# Altium schematic sheet MCU.SchDoc: Mynd-MCU
size A3; PageSetup: Record=PageOptions|CenterHorizontal=True|CenterVertical=True|PrintScale=0.71|XCorrection=1.00|YCorrection=1.00|PrintKind=0|BorderSize=5000000|LeftOffset=0|BottomOffset=0|Orientation=2|PaperLength=1000|PaperWidth=1000|Scale=100|PaperSource=7|PrintQuality=-3|MediaType=1|DitherType=10|PrintScaleMode=1|PaperKind=A4|PaperIndex=9; SheetNumber: 4; SheetTotal: 6
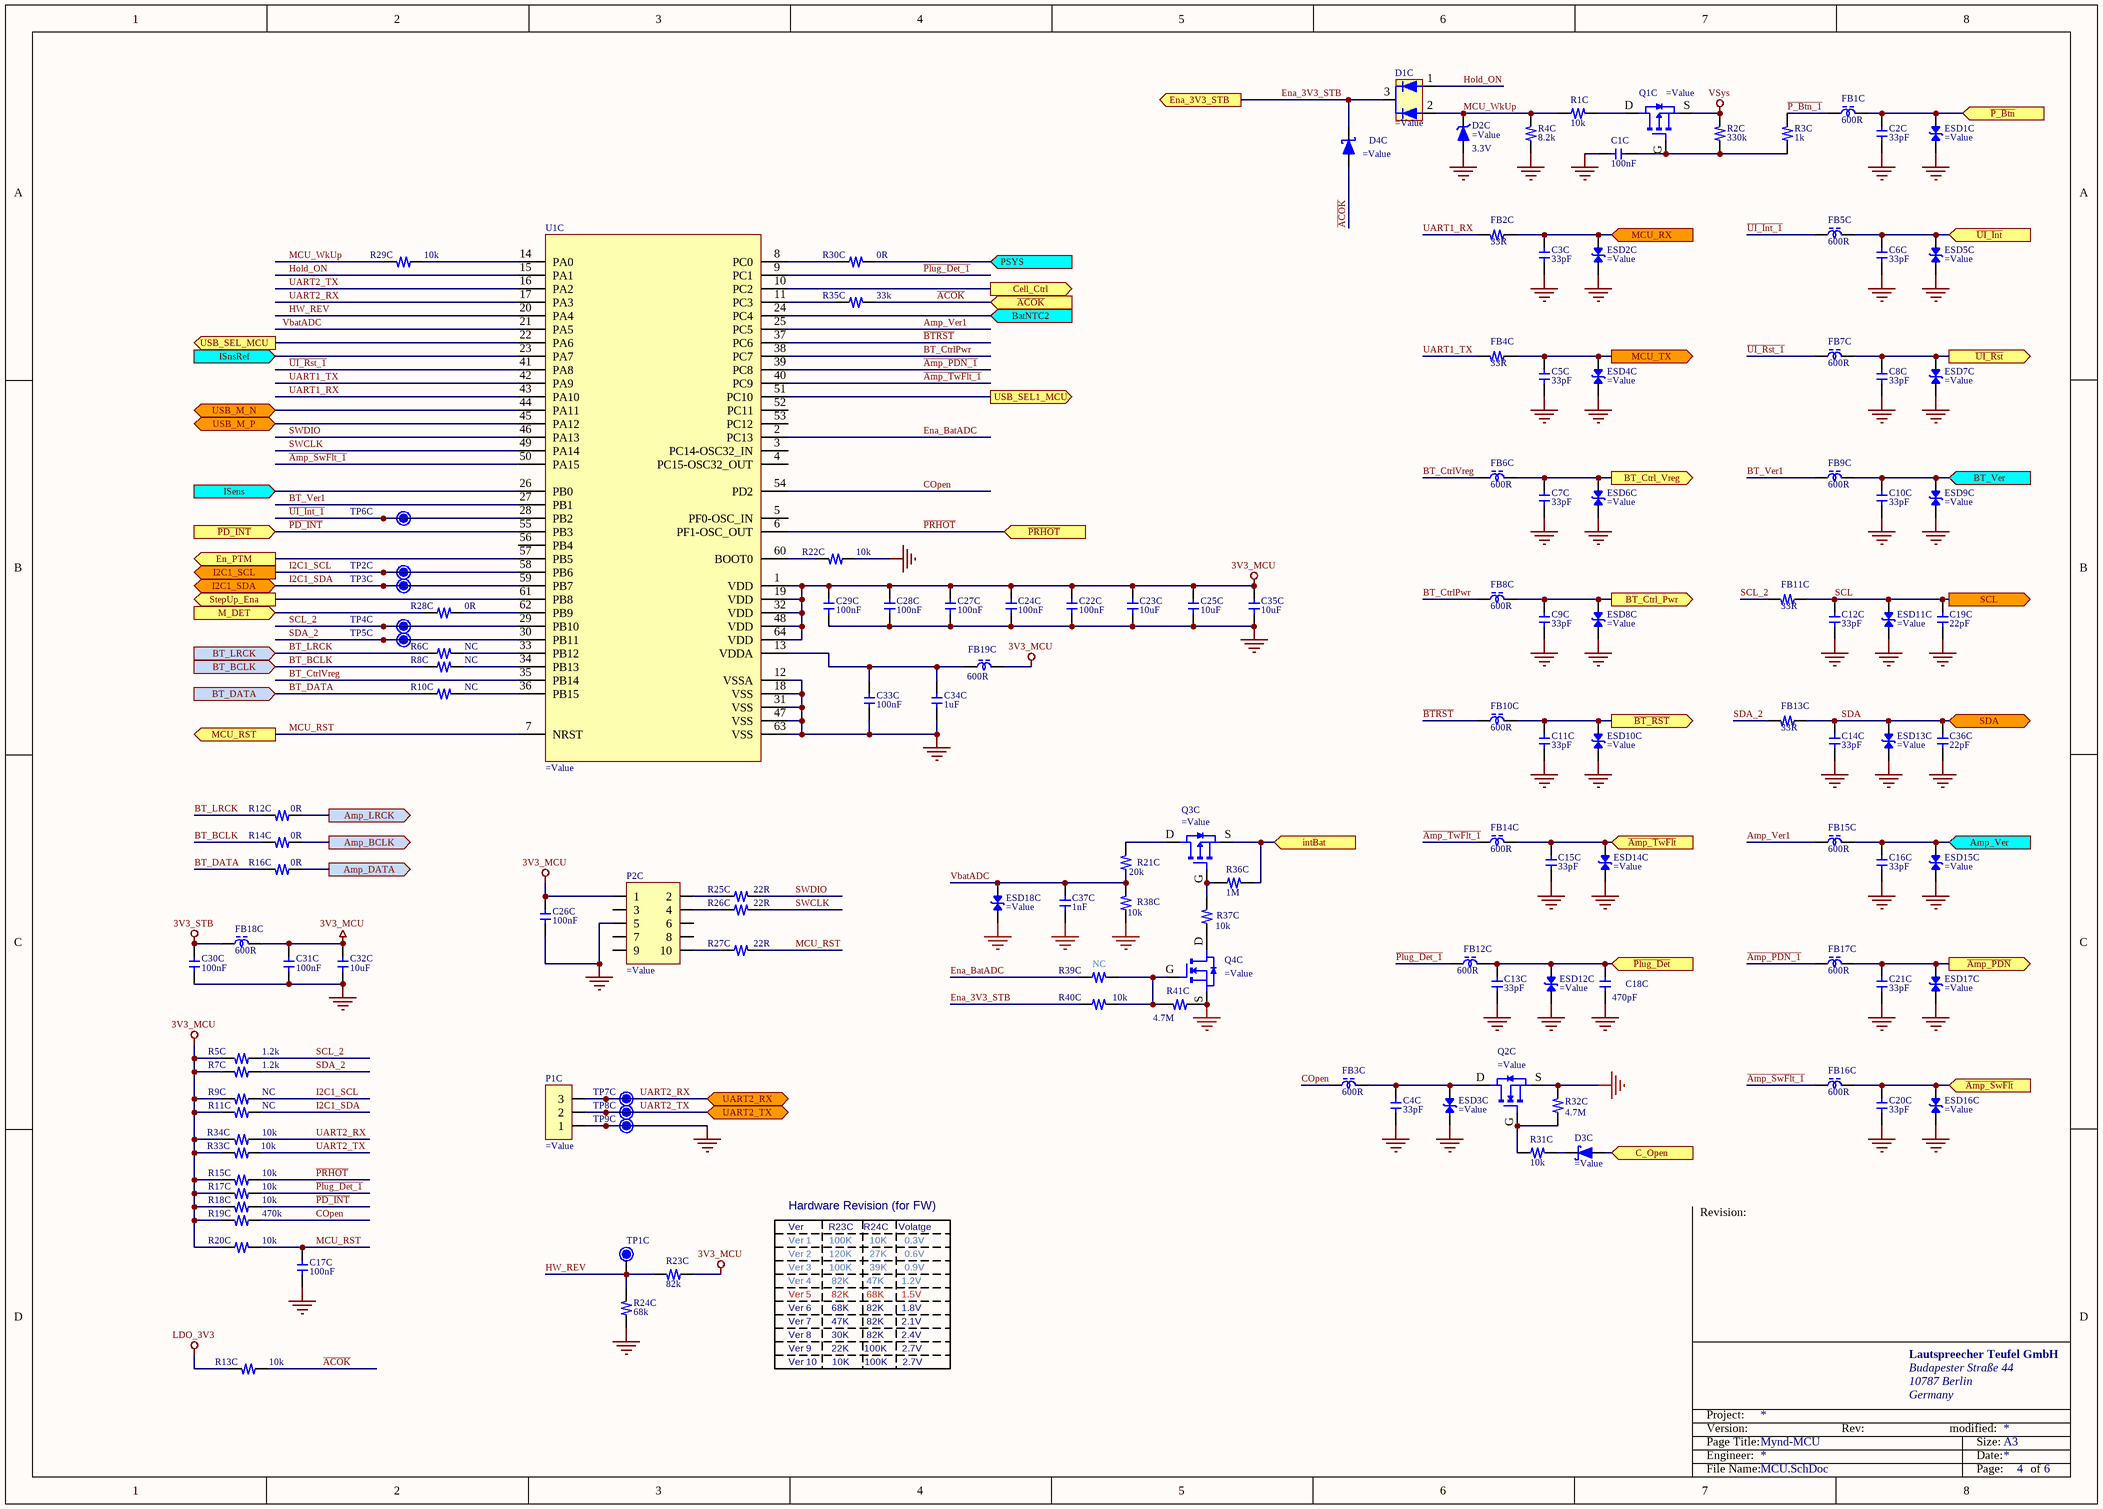
[diagram p0: MCU.SchDoc]

## Parts
C1C  100nF  [C0603X100]
C2C  33pF  [C0603X80]
C3C  33pF  [C0603X80]
C4C  33pF  [C0603X80]
C5C  33pF  [C0603X80]
C6C  33pF  [C0603X80]
C7C  33pF  [C0603X80]
C8C  33pF  [C0603X80]
C9C  33pF  [C0603X80]
C10C  33pF  [C0603X80]
C11C  33pF  [C0603X80]
C12C  33pF  [C0603X80]
C13C  33pF  [C0603X80]
C14C  33pF  [C0603X80]
C15C  33pF  [C0603X80]
C16C  33pF  [C0603X80]
C17C  100nF  [C0603X100]
C18C  470pF  [C0603X80]
C19C  22pF  [C0603X80]
C20C  33pF  [C0603X80]
C21C  33pF  [C0603X80]
C22C  100nF  [C0603X100]
C23C  10uF  [C0805_145]
C24C  100nF  [C0603X100]
C25C  10uF  [C0805_145]
C26C  100nF  [C0603X100]
C27C  100nF  [C0603X100]
C28C  100nF  [C0603X100]
C29C  100nF  [C0603X100]
C30C  100nF  [C0603X100]
C31C  100nF  [C0603X100]
C32C  10uF  [C0805_145]
C33C  100nF  [C0603X100]
C34C  1uF  [C0603X105]
C35C  10uF  [C0805_145]
C36C  22pF  [C0603X80]
C37C  1nF  [C0603X100]
D1C  (no value)  [SOT23-123]
D2C  Voltage: 3.3V  [SOD-123]
D3C  (no value)  [SOD-323]
D4C  (no value)  [SOD-323]
ESD1C  (no value)  [DFN2_100X60X50_65]
ESD2C  (no value)  [DFN2_100X60X50_65]
ESD3C  (no value)  [DFN2_100X60X50_65]
ESD4C  (no value)  [DFN2_100X60X50_65]
ESD5C  (no value)  [DFN2_100X60X50_65]
ESD6C  (no value)  [DFN2_100X60X50_65]
ESD7C  (no value)  [DFN2_100X60X50_65]
ESD8C  (no value)  [DFN2_100X60X50_65]
ESD9C  (no value)  [DFN2_100X60X50_65]
ESD10C  (no value)  [DFN2_100X60X50_65]
ESD11C  (no value)  [DFN2_100X60X50_65]
ESD12C  (no value)  [DFN2_100X60X50_65]
ESD13C  (no value)  [DFN2_100X60X50_65]
ESD14C  (no value)  [DFN2_100X60X50_65]
ESD15C  (no value)  [DFN2_100X60X50_65]
ESD16C  (no value)  [DFN2_100X60X50_65]
ESD17C  (no value)  [DFN2_100X60X50_65]
ESD18C  (no value)  [DFN2_100X60X50_65]
FB1C  600R  [L0603]
FB2C  33R  [R0603]
FB3C  600R  [L0603]
FB4C  33R  [R0603]
FB5C  600R  [L0603]
FB6C  600R  [L0603]
FB7C  600R  [L0603]
FB8C  600R  [L0603]
FB9C  600R  [L0603]
FB10C  600R  [L0603]
FB11C  33R  [R0603]
FB12C  600R  [L0603]
FB13C  33R  [R0603]
FB14C  600R  [L0603]
FB15C  600R  [L0603]
FB16C  600R  [L0603]
FB17C  600R  [L0603]
FB18C  600R  [L0603]
FB19C  600R  [L0603]
P1C  (no value)  [Pin_Header_SMD_S_T_254_3P]
P2C  (no value)  [Pin_Header_2x5_127]
Q1C  (no value)  [SOT23-GSD]
Q2C  (no value)  [SOT23-GSD]
Q3C  (no value)  [SOT23-GSD]
Q4C  (no value)  [SOT23-GSD]
R1C  10k  [R0603]
R2C  330k  [R0603]
R3C  1k  [R0603]
R4C  8.2k  [R0603]
R5C  1.2k  [R0603]
R6C  NC  [R0603]
R7C  1.2k  [R0603]
R8C  NC  [R0603]
R9C  NC  [R0603]
R10C  NC  [R0603]
R11C  NC  [R0603]
R12C  0R  [R0603]
R13C  10k  [R0603]
R14C  0R  [R0603]
R15C  10k  [R0603]
R16C  0R  [R0603]
R17C  10k  [R0603]
R18C  10k  [R0603]
R19C  470k  [R0603]
R20C  10k  [R0603]
R21C  20k  [R0603]
R22C  10k  [R0603]
R23C  82k  [R0603]
R24C  68k  [R0603]
R25C  22R  [R0603]
R26C  22R  [R0603]
R27C  22R  [R0603]
R28C  0R  [R0603]
R29C  10k  [R0603]
R30C  0R  [R0603]
R31C  10k  [R0603]
R32C  4.7M  [R0603]
R33C  10k  [R0603]
R34C  10k  [R0603]
R35C  33k  [R0603]
R36C  1M  [R0603]
R37C  10k  [R0603]
R38C  10k  [R0603]
R39C  10k  [R0603]  (value not drawn)
R40C  10k  [R0603]
R41C  4.7M  [R0603]
TP1C  TP  [TP060]  (value not drawn)  (no BOM)
TP2C  TP_T_60_40  [TP_T_60_40]  (value not drawn)  (no BOM)
TP3C  TP_T_60_40  [TP_T_60_40]  (value not drawn)  (no BOM)
TP4C  TP_T_60_40  [TP_T_60_40]  (value not drawn)  (no BOM)
TP5C  TP_T_60_40  [TP_T_60_40]  (value not drawn)  (no BOM)
TP6C  TP_T_60_40  [TP_T_60_40]  (value not drawn)  (no BOM)
TP7C  TP12  [TP120]  (value not drawn)  (no BOM)
TP8C  TP12  [TP120]  (value not drawn)  (no BOM)
TP9C  TP12  [TP120]  (value not drawn)  (no BOM)
U1C  (no value)  [LQFP64_1000X1000X160_50]

## Ports
Amp_BCLK (out), Amp_DATA (out), Amp_LRCK (out), Amp_Ver (in), BatNTC2 (in), BT_BCLK (in), BT_Ctrl_Pwr (out), BT_Ctrl_Vreg (out), BT_DATA (in), BT_LRCK (in), BT_Ver (in), C_Open (in), Cell_Ctrl (out), En_PTM (out), Ena_3V3_STB (out), I2C1_SCL (out), I2C1_SDA (bidir), intBat (in), ISens (in), ISnsRef (in), M_DET (in), MCU_RST (out), MCU_RX (in), MCU_TX (out), PSYS (in), SCL (out), SDA (bidir), StepUp_Ena (out), UART2_RX (bidir), UART2_TX (bidir), USB_M_N (bidir), USB_M_P (bidir), USB_SEL1_MCU (out), USB_SEL_MCU (out), ~{ACOK} (in), ~{Amp_PDN} (out), ~{Amp_SwFlt} (in), ~{Amp_TwFlt} (in), ~{BT_RST} (out), ~{P_Btn} (in), ~{PD_INT} (in), ~{Plug_Det} (in), ~{PRHOT} (in), ~{UI_Int} (in), ~{UI_Rst} (out)

## Nets
3V3_MCU: C22C.1 C23C.1 C24C.1 C25C.1 C26C.1 C27C.1 C28C.1 C29C.1 C31C.1 C32C.1 C35C.2 FB18C.2 FB19C.2 P2C.1 R5C.1 R7C.1 R9C.1 R11C.1 R15C.1 R17C.1 R18C.1 R19C.1 R20C.2 R23C.1 R33C.1 R34C.1 U1C.1(VDD) U1C.19(VDD) U1C.32(VDD) U1C.48(VDD) U1C.64(VDD)
3V3_STB: C30C.1 FB18C.1
GND: C1C.2 C2C.2 C3C.2 C4C.2 C5C.2 C6C.2 C7C.2 C8C.2 C9C.2 C10C.2 C11C.2 C12C.2 C13C.2 C14C.2 C15C.2 C16C.2 C17C.2 C18C.2 C19C.2 C20C.2 C21C.2 C22C.2 C23C.2 C24C.2 C25C.2 C26C.2 C27C.2 C28C.2 C29C.2 C30C.2 C31C.2 C32C.2 C33C.2 C34C.2 C35C.1 C36C.2 C37C.2 D2C.A ESD1C.2 ESD2C.1 ESD3C.1 ESD4C.1 ESD5C.1 ESD6C.1 ESD7C.1 ESD8C.1 ESD9C.1 ESD10C.1 ESD11C.1 ESD12C.1 ESD13C.1 ESD14C.1 ESD15C.1 ESD16C.1 ESD17C.1 ESD18C.1 P1C.1 P2C.5 Q2C.S Q4C.S R4C.1 R22C.1 R24C.1 R32C.2 R38C.1 R41C.2 TP9C.1 U1C.12(VSSA) U1C.18(VSS) U1C.31(VSS) U1C.47(VSS) U1C.63(VSS)
LDO_3V3: R13C.1
VSys: Q1C.S R2C.2
~{ACOK}: D4C.A R13C.2 R35C.1 ; port ~{ACOK}
~{Amp_PDN_1}: FB17C.1 U1C.39(PC8)
~{Amp_SwFlt_1}: FB16C.1 U1C.50(PA15)
~{Amp_TwFlt_1}: FB14C.1 U1C.40(PC9)
~{BT_RST}: C11C.1 ESD10C.2 FB10C.2 ; port ~{BT_RST}
~{BTRST}: FB10C.1 U1C.37(PC6)
~{P_Btn}: C2C.1 ESD1C.1 FB1C.2 ; port ~{P_Btn}
~{P_Btn_1}: FB1C.1 R3C.2
~{PD_INT}: R18C.2 U1C.55(PB3) ; port ~{PD_INT}
~{Plug_Det}: C13C.1 C18C.1 ESD12C.2 FB12C.2 ; port ~{Plug_Det}
~{Plug_Det_1}: FB12C.1 R17C.2 U1C.9(PC1)
~{PRHOT}: R15C.2 U1C.6(PF1-OSC_OUT) ; port ~{PRHOT}
~{UI_Int}: C6C.1 ESD5C.2 FB5C.2 ; port ~{UI_Int}
~{UI_Int_1}: FB5C.1 TP6C.1 U1C.28(PB2)
~{UI_Rst}: C8C.1 ESD7C.2 FB7C.2 ; port ~{UI_Rst}
~{UI_Rst_1}: FB7C.1 U1C.41(PA8)
~{Amp_PDN}: C21C.1 ESD17C.2 FB17C.2 ; port ~{Amp_PDN}
~{Amp_SwFlt}: C20C.1 ESD16C.2 FB16C.2 ; port ~{Amp_SwFlt}
~{Amp_TwFlt}: C15C.1 ESD14C.2 FB14C.2 ; port ~{Amp_TwFlt}
Amp_BCLK: R14C.2 ; port Amp_BCLK
Amp_DATA: R16C.2 ; port Amp_DATA
Amp_LRCK: R12C.2 ; port Amp_LRCK
Amp_Ver: C16C.1 ESD15C.2 FB15C.2 ; port Amp_Ver
Amp_Ver1: FB15C.1 U1C.25(PC5)
BatNTC2: U1C.24(PC4) ; port BatNTC2
BT_BCLK: R8C.2 R14C.1 ; port BT_BCLK
BT_Ctrl_Pwr: C9C.1 ESD8C.2 FB8C.2 ; port BT_Ctrl_Pwr
BT_Ctrl_Vreg: C7C.1 ESD6C.2 FB6C.2 ; port BT_Ctrl_Vreg
BT_CtrlPwr: FB8C.1 U1C.38(PC7)
BT_CtrlVreg: FB6C.1 U1C.35(PB14)
BT_DATA: R10C.2 R16C.1 ; port BT_DATA
BT_LRCK: R6C.2 R12C.1 ; port BT_LRCK
BT_Ver: C10C.1 ESD9C.2 FB9C.2 ; port BT_Ver
BT_Ver1: FB9C.1 U1C.27(PB1)
C_Open: D3C.A ; port C_Open
Cell_Ctrl: U1C.10(PC2) ; port Cell_Ctrl
COpen: FB3C.1 R19C.2 U1C.54(PD2)
En_PTM: U1C.57(PB5) ; port En_PTM
Ena_3V3_STB: D1C.3 D4C.K R40C.1 ; port Ena_3V3_STB
Ena_BatADC: R39C.1 U1C.2(PC13)
Hold_ON: D1C.1 U1C.15(PA1)
HW_REV: R23C.2 R24C.2 TP1C.1 U1C.20(PA4)
I2C1_SCL: R9C.2 TP2C.1 U1C.58(PB6) ; port I2C1_SCL
I2C1_SDA: R11C.2 TP3C.1 U1C.59(PB7) ; port I2C1_SDA
intBat: Q3C.S R36C.2 ; port intBat
ISens: U1C.26(PB0) ; port ISens
ISnsRef: U1C.23(PA7) ; port ISnsRef
M_DET: R28C.2 ; port M_DET
MCU_RST: C17C.1 R20C.1 R27C.1 U1C.7(NRST) ; port MCU_RST
MCU_RX: C3C.1 ESD2C.2 FB2C.2 ; port MCU_RX
MCU_TX: C5C.1 ESD4C.2 FB4C.2 ; port MCU_TX
MCU_WkUp: D1C.2 D2C.K R1C.1 R4C.2 R29C.2
PSYS: R30C.1 ; port PSYS
SCL: C12C.1 C19C.1 ESD11C.2 FB11C.2 ; port SCL
SCL_2: FB11C.1 R5C.2 TP4C.1 U1C.29(PB10)
SDA: C14C.1 C36C.1 ESD13C.2 FB13C.2 ; port SDA
SDA_2: FB13C.1 R7C.2 TP5C.1 U1C.30(PB11)
StepUp_Ena: U1C.61(PB8) ; port StepUp_Ena
SWCLK: R26C.1 U1C.49(PA14)
SWDIO: R25C.1 U1C.46(PA13)
UART1_RX: FB2C.1 U1C.43(PA10)
UART1_TX: FB4C.1 U1C.42(PA9)
UART2_RX: P1C.3 R34C.2 TP7C.1 U1C.17(PA3) ; port UART2_RX
UART2_TX: P1C.2 R33C.2 TP8C.1 U1C.16(PA2) ; port UART2_TX
USB_M_N: U1C.44(PA11) ; port USB_M_N
USB_M_P: U1C.45(PA12) ; port USB_M_P
USB_SEL1_MCU: U1C.51(PC10) ; port USB_SEL1_MCU
USB_SEL_MCU: U1C.22(PA6) ; port USB_SEL_MCU
VbatADC: C37C.1 ESD18C.2 R21C.1 R38C.2 U1C.21(PA5)
NetC1C_1: C1C.1 Q1C.G R2C.1 R3C.1
NetC4C_1: C4C.1 ESD3C.2 FB3C.2 Q2C.D
NetC33C_1: C33C.1 C34C.1 FB19C.1 U1C.13(VDDA)
NetD3C_K: D3C.K R31C.1
NetP2C_2: P2C.2 R25C.2
NetP2C_4: P2C.4 R26C.2
NetP2C_10: P2C.10 R27C.2
NetQ1C_D: Q1C.D R1C.2
NetQ2C_G: Q2C.G R31C.2 R32C.1
NetQ3C_D: Q3C.D R21C.2
NetQ3C_G: Q3C.G R36C.1 R37C.2
NetQ4C_D: Q4C.D R37C.1
NetQ4C_G: Q4C.G R39C.2 R40C.2 R41C.1
NetR6C_1: R6C.1 U1C.33(PB12)
NetR8C_1: R8C.1 U1C.34(PB13)
NetR10C_1: R10C.1 U1C.36(PB15)
NetR22C_2: R22C.2 U1C.60(BOOT0)
NetR28C_1: R28C.1 U1C.62(PB9)
NetR29C_1: R29C.1 U1C.14(PA0)
NetR30C_2: R30C.2 U1C.8(PC0)
NetR35C_2: R35C.2 U1C.11(PC3)

Not connected (* = marked no-connect by the designer): P2C 3 6 7 8 9; U1C 3(PC14-OSC32_IN) 4(PC15-OSC32_OUT) 5(PF0-OSC_IN) 52(PC11) 53(PC12) 56(PB4)

## Notes on the sheet
- (near R39C) NC
- Ver 1       100K       10K       0.3V
- Ver          R23C    R24C    Volatge
- Hardware Revision (for FW)
- Ver 2       120K       27K       0.6V
- Ver 3       100K       39K       0.9V
- Ver 4        82K       47K       1.2V
- Ver 5        82K       68K       1.5V
- Ver 6        68K       82K       1.8V
- Ver 7        47K       82K       2.1V
- Ver 8        30K       82K       2.4V
- Ver 9        22K      100K      2.7V
- Ver 10      10K      100K      2.7V
- Revision:
- Lautspreecher Teufel GmbH
- Budapester Straße 44
- 10787 Berlin
- Germany
- Page Title:
- Engineer:
- Project:
- Version:
- Rev:
- modified:
- Date:
- Size:
- A3
- File Name:
- Page:
- of

## Library data of the parts
C1C C17C C22C C24C C26C C27C C28C C29C C30C C31C C33C = P-001-0074-61: PSHF SMD M CAP 100nF 50V ±10% 0603 X7R; Manufacturer: Multi Sourced; Part_Number: Generic; Part_Type: Capacitor ceramic SMT; Tolerance: ±10%; TemperatureRange: X7R; Value: 100nF; Temp_Coefficient: X7R; Voltage: 50V
C2C C3C C4C C5C C6C C7C C8C C9C C10C C11C C12C C13C C14C C15C C16C C20C C21C = P-001-0394-18: PSHF SMD M CAP 33pF 50V ±5% 0603 NPO; Manufacturer: Multi Sourced; Part_Number: Generic; Part_Type: Capacitor ceramic SMT; Tolerance: ±5%; TemperatureRange: NPO; Value: 33pF; Temp_Coefficient: NPO; Voltage: 50V
C18C = P-001-0647-10: GPHF SMD CAP 470pF 50V 10%; Manufacturer: Multi Sourced; Part_Number: Generic; Part_Type: Capacitor ceramic SMT; TemperatureRange: X7R; Tolerance: ±10%; Value: 470pF; Temp_Coefficient: X7R; Voltage: 50V
C19C C36C = P-001-0244-44: GPHF SMD M CAP 22pF 50V ±5% 0603 NPO; Manufacturer: Multi Sourced; Part_Number: Generic; Part_Type: Capacitor ceramic SMT; Tolerance: ±5%; TemperatureRange: NPO; Value: 22pF; Temp_Coefficient: NPO; Voltage: 50V
C23C C25C C32C C35C = P-001-0158-27: PSHF SMD M CAP 10uF 16V ±10% 0805 X7R; Manufacturer: Multi Sourced; Part_Number: Generic; Part_Type: Capacitor ceramic SMT; Tolerance: ±10%; TemperatureRange: X7R; Value: 10uF; Temp_Coefficient: X7R; Voltage: 16V
C34C = P-001-0040-42: PSHF SMD M CAP 1uF 16V ±10% 0603 X7R; Manufacturer: Multi Sourced; Part_Number: Generic; Part_Type: Capacitor ceramic SMT; Tolerance: ±10%; TemperatureRange: X7R; Value: 1uF; Temp_Coefficient: X7R; Voltage: 16V
C37C = P-001-0073-51: GPHF SMD M CAP 1nF 50V ±10% 0603 X7R; Manufacturer: Multi Sourced; Part_Number: Generic; Part_Type: Capacitor ceramic SMT; Tolerance: ±10%; TemperatureRange: X7R; Value: 1nF; Temp_Coefficient: X7R; Voltage: 50V
D1C = R-001-0027-12: PS SMD DIODE 3P 30V SOT-23 BAT54C CJ; Manufacturer: [CJ]; Part_Type: Semiconductor Diode SMT; Current: 0.2A; Voltage: 30V; Value: BAT54C; Part_Number: BAT54C
D2C = R-001-0336-16: GP SMD ZENER 3.3V 0.5W SOD-123 CJ; Manufacturer: [CJ]; Part_Type: Semiconductor Diode Zener; Value: BZT52C3V3; Part_Number: BZT52C3V3
D3C D4C = R-001-0029-31: GP SMD DIODE 2P 30V SOD323 BAT54WS PANJIT; Part_Type: Semiconductor Diode SMT; Current: 0.2A; Manufacturer: PANJIT; Voltage: 30V; Value: BAT54WS; Part_Number: BAT54WS
ESD1C = R-001-1347-2: SMD TVS 2P DFN1006 BDFN2C121V; Manufacturer: []; Part_Type: Semiconductor Diode TVS; Value: BDFN2C121V; Part_Number: BDFN2C121V
ESD2C ESD3C ESD4C ESD5C ESD6C ESD7C ESD8C ESD9C ESD10C ESD11C ESD12C ESD13C ESD14C ESD15C ESD16C ESD17C ESD18C = R-001-0237-38: GP SMD TVS 2P DFN1006-2 AU3321P1 APM; Part_Type: Semiconductor Diode TVS; Voltage: 3.3V; Manufacturer: APM; Value: AU3321P1; Part_Number: AU3321P1
FB1C FB3C FB5C FB6C FB7C FB8C FB9C FB10C FB14C FB15C FB16C FB17C FB18C FB19C = S-001-0008-33: PSHF SMD FERRITE BEAD 600OHM 25% 0603; Manufacturer: TSA; Part_Number: HCB1608KF-601T20; Part_Type: Ferrite Bead SMT; Current: 2A; Tolerance: 1:25%; Frequency: 100MHZ; Value: 600R
FB2C FB4C FB11C FB13C = Q-001-0059-31: GPHF SMD RES. 33OHM 1/10W 5% 0603; Manufacturer: Multi-Sourced; Part_Number: Generic; Part_Type: Resistor SMT; Temp_Coefficient: 150ppm; Tolerance: 5%; Wattage: 1/10W; Value: 33R
FB12C = S-001-0008-33: PSHF SMD FERRITE BEAD 600OHM 25% 0603; Manufacturer: TSA; Part_Number: HCB1608KF-601T20; Part_Type: Ferrite Bead SMT; Tolerance: 1:25%; Frequency: 100MHZ; Current: 2A; Value: 600R
P1C = C-001-0512-9: GP HEADER PIN 3P P=2.54mm 90° GOLD; Manufacturer: [null]; Part_Type: Connector SMT; Value: 3P PITCH=2.54mm; Part_Number: 3P PITCH=2.54mm
P2C = C-001-1091-2: SMD BTB CONNECTOR 10P P1.27mm GOLD; Manufacturer: MINGHENG; Part_Type: Connector SMT; Value: 1.27PH 2X5P H2.0 SMT; Part_Number: 1.27PH 2X5P H2.0 SMT
Q1C Q3C = R-001-1323-4: GS SMD FET 3P -30V SOT-23 CJ3401 CJ; Manufacturer: [CJ]; Part_Type: Semiconductor Transistor SMT; Current: -4.2V; Voltage: -30; Value: CJ3401; Part_Number: CJ3401
Q2C Q4C = R-001-0217-30: GP SMD FET 3P SOT23 2N7002K CTE; Part_Type: Semiconductor Transistor SMT; Current: 300MA; Voltage: 60V; Manufacturer: CTE; Value: 2N7002K; Part_Number: 2N7002K
R1C R9C R11C R13C R15C R17C R18C R20C R22C R29C R33C R34C = Q-001-0036-48: PS SMD RES. 10KOHM 1/10W 1% 0603; Part_Type: Resistor SMT; Manufacturer: Multi-Sourced; Part_Number: Generic; Temp_Coefficient: 150ppm; Tolerance: 1%; Wattage: 1/10W
  R1C R13C R15C R17C R18C R20C R22C R29C R33C R34C: Value: 10k
  R9C R11C: Value: NC
R2C = Q-001-0378-19: PS SMD RES. 330KOHM 1/10W 1% 0603; Part_Type: Resistor SMT; Manufacturer: Multi-Sourced; Part_Number: Generic; Temp_Coefficient: 150ppm; Tolerance: 1%; Value: 330k; Wattage: 1/10W
R3C = Q-001-0033-26: PS SMD RES. 1KOHM 1/10W 1% 0603; Part_Type: Resistor SMT; Manufacturer: Multi-Sourced; Part_Number: Generic; Temp_Coefficient: 150ppm; Tolerance: 1%; Value: 1k; Wattage: 1/10W
R4C = Q-001-0049-26: PS SMD RES. 8.2KOHM 1/10W 1% 0603; Part_Type: Resistor SMT; Manufacturer: Multi-Sourced; Part_Number: Generic; Temp_Coefficient: 150ppm; Tolerance: 1%; Value: 8.2k; Wattage: 1/10W
R5C R7C = Q-001-0265-28: PS SMD RES. 1.2KOHM 1/10W 1% 0603; Part_Type: Resistor SMT; Manufacturer: Multi-Sourced; Part_Number: Generic; Temp_Coefficient: 150ppm; Tolerance: 1%; Value: 1.2k; Wattage: 1/10W
R6C R8C R10C R28C = Q-001-0048-199: PS SMD RES. 0OHM 1/10W 5% 0603; Manufacturer: Multi-Sourced; Part_Number: Generic; Part_Type: Resistor SMT; Temp_Coefficient: 150ppm; Tolerance: 5%; Wattage: 1/10W
  R6C R8C R10C: Value: NC
  R28C: Value: 0R
R12C R14C R16C R30C = Q-001-0048-199: PS SMD RES. 0OHM 1/10W 5% 0603; Part_Type: Resistor SMT; Manufacturer: Multi-Sourced; Part_Number: Generic; Tolerance: 1%; Temp_Coefficient: 150ppm; Value: 0R; Wattage: 1/10W
R19C = Q-001-0432-19: PS SMD RES. 470KOHM 1/10W 1% 0603; Part_Type: Resistor SMT; Manufacturer: Multi-Sourced; Part_Number: Generic; Temp_Coefficient: 150ppm; Tolerance: 1%; Value: 470k; Wattage: 1/10W
R21C = Q-001-0323-29: GPHF SMD RES. 20KOHM 1/10W 1% 0603; Manufacturer: Multi-Sourced; Part_Number: Generic; Part_Type: Resistor SMT; Temp_Coefficient: 150ppm; Tolerance: 1%; Wattage: 1/10W; Value: 20k
R23C = Q-001-0026-26: GPHF SMD RES. 82KOHM 1/10W 1% 0603; Manufacturer: Multi-Sourced; Part_Number: Generic; Part_Type: Resistor SMT; Temp_Coefficient: 150ppm; Tolerance: 1%; Wattage: 1/10W; Value: 82k
R24C = Q-001-0485-26: GPHF SMD RES. 68KOHM 1/10W 1% 0603; Manufacturer: Multi-Sourced; Part_Number: Generic; Part_Type: Resistor SMT; Temp_Coefficient: 150ppm; Tolerance: 1%; Wattage: 1/10W; Value: 68k
R25C R26C R27C = Q-001-0242-29: PS SMD RES. 22OHM 1/10W 5% 0603; Part_Type: Resistor SMT; Manufacturer: Multi-Sourced; Part_Number: Generic; Tolerance: 1%; Temp_Coefficient: 150ppm; Value: 22R; Wattage: 1/10W
R31C R37C R38C R39C R40C = Q-001-0036-49: PS SMD RES. 10KOHM 1/10W 1% 0603; Manufacturer: Multi-Sourced; Part_Number: Generic; Part_Type: Resistor SMT; Temp_Coefficient: 150ppm; Tolerance: 1%; Wattage: 1/10W; Value: 10k
R32C R41C = Q-001-0091-19: PS SMD RES. 4.7MOHM 1/10W 5% 0603; Manufacturer: Multi-Sourced; Part_Number: Generic; Part_Type: Resistor SMT; Temp_Coefficient: 150ppm; Tolerance: 5%; Wattage: 1/10W; Value: 4.7M
R35C = Q-001-0388-45: GPHF SMD RES. 33KOHM 1/10W 1% 0603; Manufacturer: Multi-Sourced; Part_Number: Generic; Part_Type: Resistor SMT; Temp_Coefficient: 150ppm; Tolerance: 1%; Wattage: 1/10W; Value: 33k
R36C = Q-001-0044-22: GPHF SMD RES. 1MOHM 1/10W 1% 0603; Manufacturer: Multi-Sourced; Part_Number: Generic; Part_Type: Resistor SMT; Temp_Coefficient: 150ppm; Tolerance: 1%; Wattage: 1/10W; Value: 1M
TP1C = N-001-00007-3: Test Point; Design Item ID: TP
TP2C TP3C TP4C TP5C TP6C = CMP-00089-1: Test Point; Design Item ID: TP
TP7C TP8C TP9C = N-001-00010-2: Test Point; Design Item ID: TP
U1C = R-001-1651-2: SMD IC 64P LQFP STM32F072RBT6 ST; Part_Type: Semiconductor Integrated Circuit SMT; Manufacturer: ST; Part_Number: STM32F072RBT6; Value: STM32F072RBT6